# Altium schematic sheet Sheet1.SchDoc
size A3
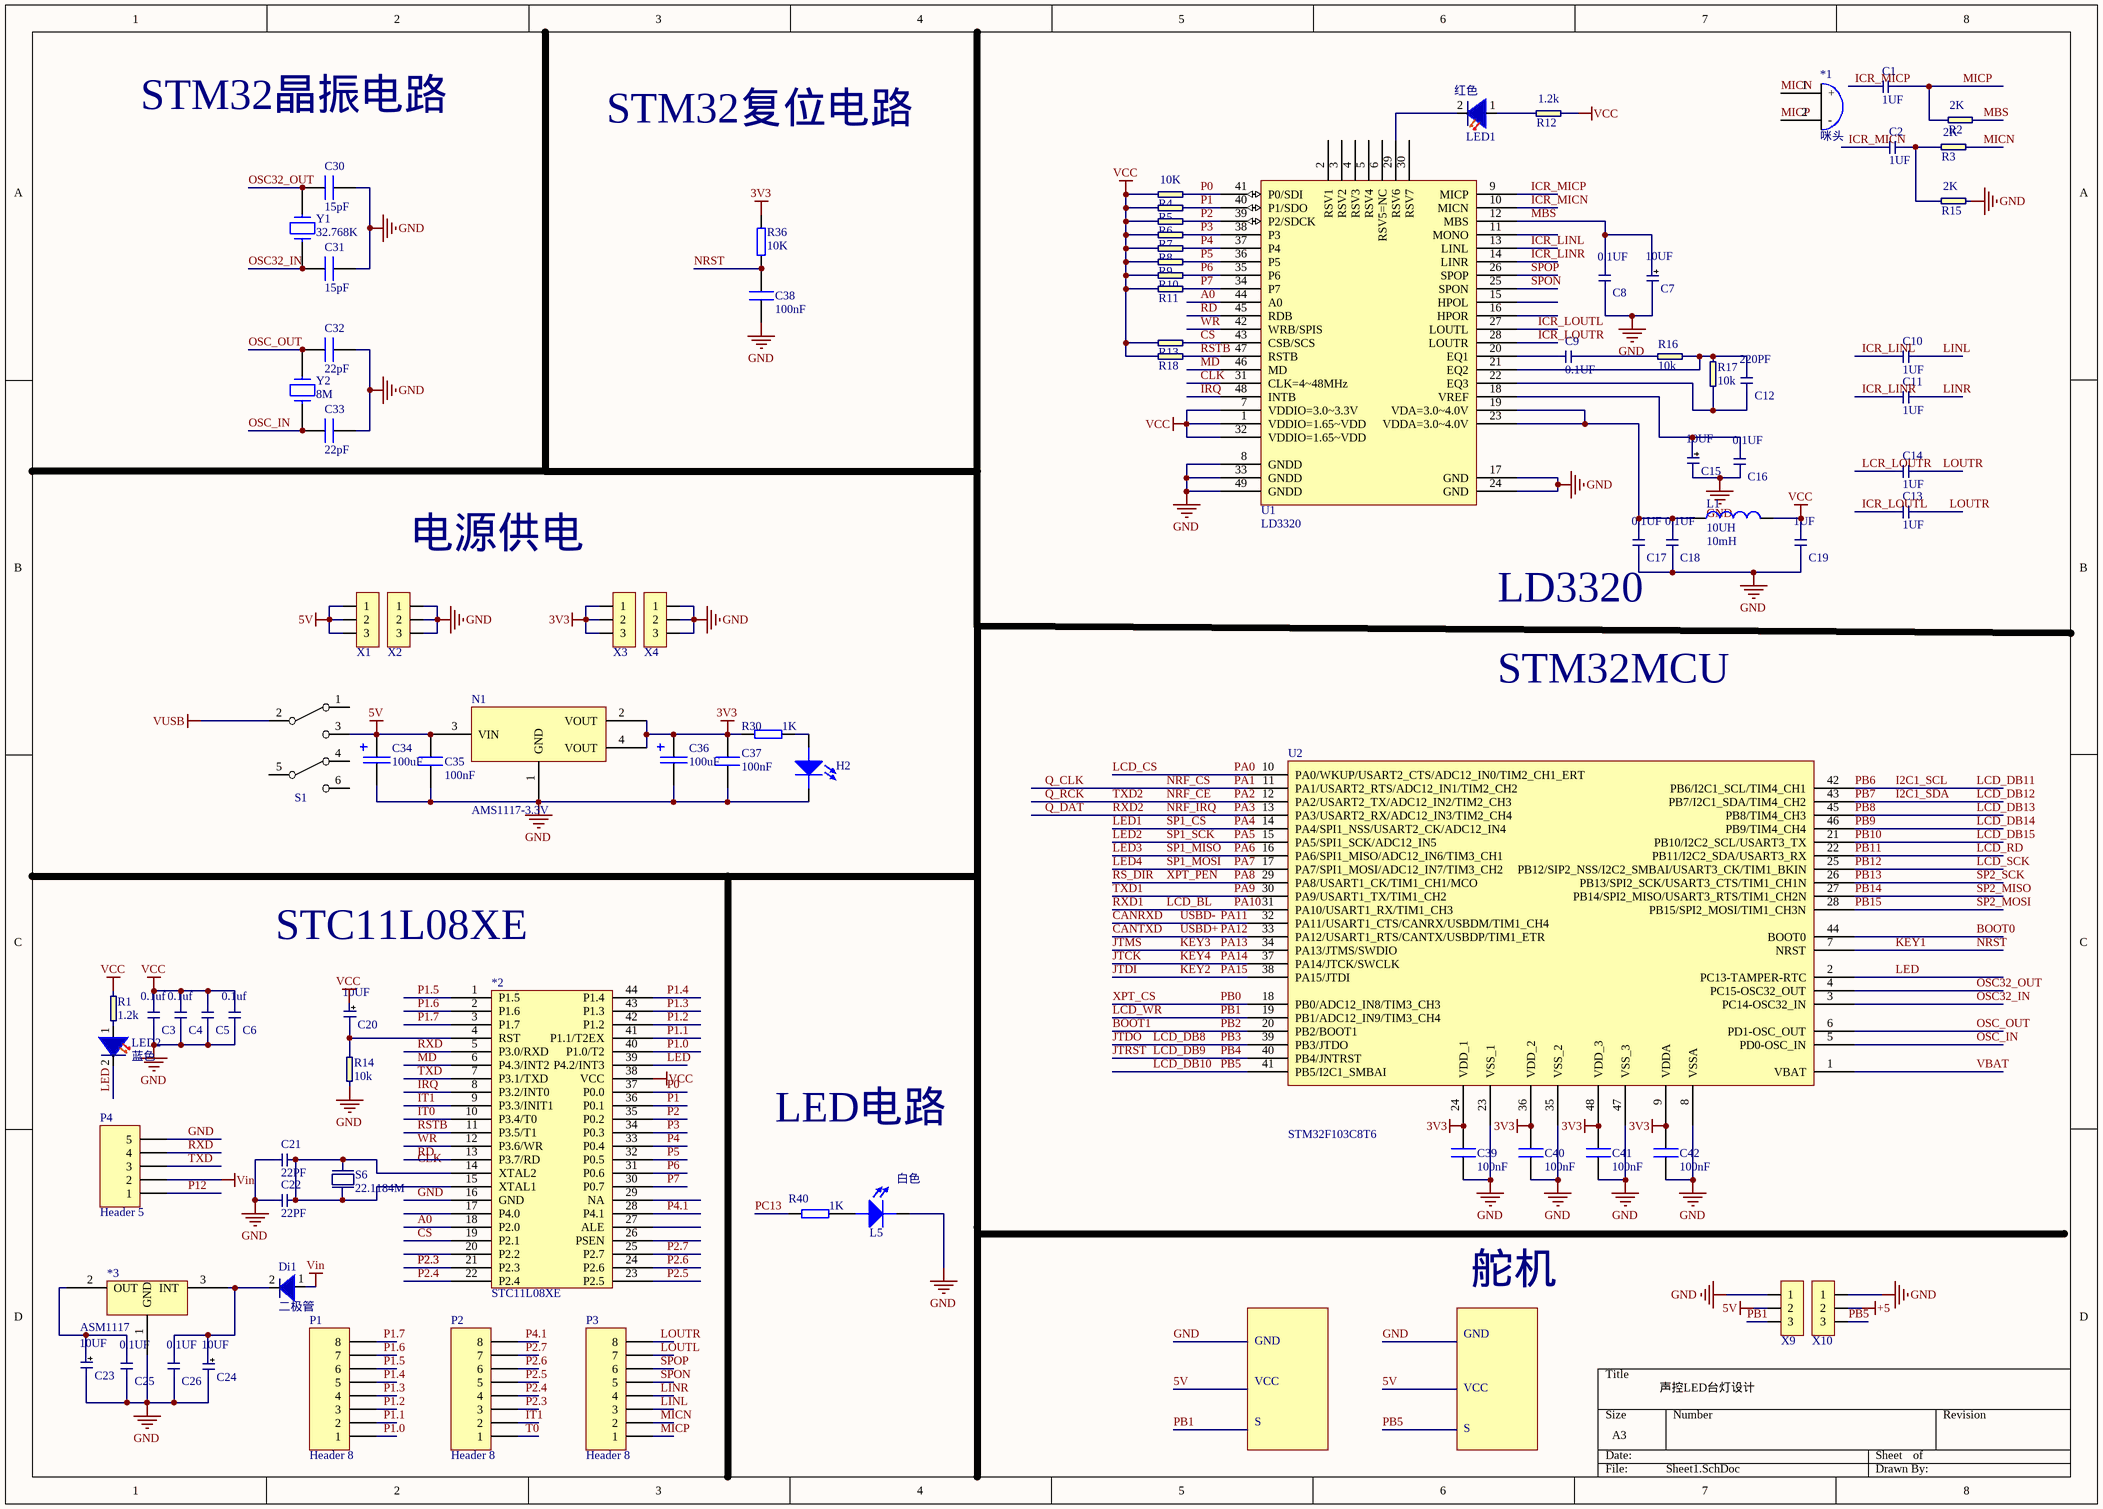
[diagram p0: Sheet1.SchDoc]

## Parts
*1  咪头  [CAPPR5-5x5]
*2  STC11L08XE  [LQFP44]
*3  ASM1117  [ASM1117]
C1  1UF  [CT2mm]
C2  1UF  [CT2mm]
C3  0.1uf  [CT2mm]
C4  0.1uf  [CT2mm]
C5  0.1uf  [CT2mm]  (value not drawn)
C6  0.1uf  [CT2mm]
C7  10UF  [Rt2mm]
C8  0.1UF  [CT2mm]
C9  0.1UF  [CT2mm]
C10  1UF  [CT2mm]
C11  1UF  [CT2mm]
C12  220PF  [CT2mm]
C13  1UF  [CT2mm]
C14  1UF  [CT2mm]
C15  10UF  [Rt2mm]
C16  0.1UF  [CT2mm]
C17  0.1UF  [CT2mm]
C18  0.1UF  [CT2mm]
C19  1UF  [CT2mm]
C20  10UF  [Rt2mm]
C21  22PF  [CT2mm]
C22  22PF  [CT2mm]
C23  10UF  [Rt2mm]
C24  10UF  [Rt2mm]
C25  0.1UF  [CT2mm]
C26  0.1UF  [CT2mm]
C30  15pF  [C0805]
C31  15pF  [C0805]
C32  22pF  [C0805]
C33  22pF  [C0805]
C34  100uF  [CAP5*5_4]
C35  100nF  [C0805]
C36  100uF  [CAP5*5_4]
C37  100nF  [C0805]
C38  100nF  [C0805]
C39  100nF  [C0805]
C40  100nF  [C0805]
C41  100nF  [C0805]
C42  100nF  [C0805]
Di1  二极管  [DT4mm]
H2  发光二极管  [LED1206]  (value not drawn)
L1  10UH  value 10mH  [INDC1005AL]
L5  发光二极管  [LED1206]  (value not drawn)
LED1  红色  [LEDT]
LED2  蓝色  [LEDT]
N1  AMS1117-3.3V  [SOT223]
P1  Header 8  [HD8]
P2  Header 8  [HD8]
P3  Header 8  [HD8]
P4  Header 5  [HD5]
R1  1.2k  [Rt2mm]
R2  2K  [Rt2mm]
R3  2K  [Rt2mm]
R4  10K  [Rt2mm]
R5  RES  [Rt2mm]  (value not drawn)
R6  RES  [Rt2mm]  (value not drawn)
R7  RES  [Rt2mm]  (value not drawn)
R8  RES  [Rt2mm]  (value not drawn)
R9  RES  [Rt2mm]  (value not drawn)
R10  RES  [Rt2mm]  (value not drawn)
R11  RES  [Rt2mm]  (value not drawn)
R12  1.2k  [Rt2mm]
R13  RES  [Rt2mm]  (value not drawn)
R14  10k  [Rt2mm]
R15  2K  [Rt2mm]
R16  10k  [Rt2mm]
R17  10k  [Rt2mm]
R18  RES  [Rt2mm]  (value not drawn)
R30  1K  [R0805]
R36  10K  [R0805]
R40  1K  [R0805]
S1  SWITCH-6  [SW-AJ]  (value not drawn)
S6  22.1184M  [晶振]
U1  LD3320  [QFN50P700X700X80-48N]
U2  STM32F103C8T6  [LQFP48]
X1  JX3  [SIP3]  (value not drawn)
X2  JX3  [SIP3]  (value not drawn)
X3  JX3  [SIP3]  (value not drawn)
X4  JX3  [SIP3]  (value not drawn)
X9  JX3  [SIP3]  (value not drawn)
X10  JX3  [SIP3]  (value not drawn)
Y1  32.768K  [FC135]
Y2  8M  [JZ-AX]

## Nets
3V3: C36.1 C37.1 C39.1 C40.1 C41.1 C42.1 N1.2(VOUT) N1.4(VOUT) R30.1 R36.2 U2.9(VDDA) U2.24(VDD_1) U2.36(VDD_2) U2.48(VDD_3) X3.1 X3.2 X3.3
5V: C34.1 C35.1 N1.3(VIN) S1.3 X1.1 X1.2 X1.3 X9.2
+5: X10.2
GND: *2.16(GND) *3.1(GND) C3.1 C4.1 C5.1 C6.1 C7.2 C8.1 C15.2 C16.1 C17.1 C18.1 C19.1 C21.2 C22.2 C23.2 C24.2 C25.1 C26.1 C30.2 C31.2 C32.2 C33.2 C34.2 C35.2 C36.2 C37.2 C38.1 C39.2 C40.2 C41.2 C42.2 H2.2(K) L5.2(K) N1.1(GND) P4.5 R14.1 R15.2 U1.8(GNDD) U1.17(GND) U1.24(GND) U1.33(GNDD) U1.49(GNDD) U2.8(VSSA) U2.23(VSS_1) U2.35(VSS_2) U2.47(VSS_3) X2.1 X2.2 X2.3 X4.1 X4.2 X4.3 X9.1 X10.1
VCC: *2.38(VCC) C3.2 C4.2 C5.2 C6.2 C19.2 C20.1 L1.2 R1.2 R4.1 R5.1 R6.1 R7.1 R8.1 R9.1 R10.1 R11.1 R12.2 R13.1 R18.1 U1.1(VDDIO=1.65~VDD) U1.7(VDDIO=3.0~3.3V) U1.32(VDDIO=1.65~VDD)
Vin: Di1.1 P4.2
VUSB: S1.2
A0: *2.18(P2.0) U1.44(A0)
BOOT0: U2.44(BOOT0)
BOOT1: U2.20(PB2/BOOT1)  [also labelled PB2]
CANRXD: U2.32(PA11/USART1_CTS/CANRX/USBDM/TIM1_CH4)  [also labelled PA11, USBD-]
CANTXD: U2.33(PA12/USART1_RTS/CANTX/USBDP/TIM1_ETR)  [also labelled PA12, USBD+]
CLK: U1.31(CLK=4~48MHz)
CS: *2.19(P2.1) R13.2 U1.43(CSB/SCS)
I2C1_SCL: U2.42(PB6/I2C1_SCL/TIM4_CH1)  [also labelled LCD_DB11, PB6]
I2C1_SDA: U2.43(PB7/I2C1_SDA/TIM4_CH2)  [also labelled LCD_DB12, PB7]
ICR_LINL: C10.2 U1.13(LINL)
ICR_LINR: C11.2 U1.14(LINR)
ICR_LOUTL: C13.2 U1.27(LOUTL)
ICR_LOUTR: U1.28(LOUTR)
ICR_MICN: C2.2 U1.10(MICN)
ICR_MICP: C1.2 U1.9(MICP)
IRQ: *2.8(P3.2/INT0) U1.48(INTB)
IT0: *2.10(P3.4/T0)
IT1: *2.9(P3.3/INIT1) P2.2
JTCK: U2.37(PA14/JTCK/SWCLK)  [also labelled KEY4, PA14]
JTDI: U2.38(PA15/JTDI)  [also labelled KEY2, PA15]
JTDO: U2.39(PB3/JTDO)  [also labelled LCD_DB8, PB3]
JTMS: U2.34(PA13/JTMS/SWDIO)  [also labelled KEY3, PA13]
JTRST: U2.40(PB4/JNTRST)  [also labelled LCD_DB9, PB4]
KEY1: C38.2 R36.1 U2.7(NRST)  [also labelled NRST]
LCD_BL: U2.31(PA10/USART1_RX/TIM1_CH3)  [also labelled PA10, RXD1]
LCD_CS: U2.10(PA0/WKUP/USART2_CTS/ADC12_IN0/TIM2_CH1_ERT)  [also labelled PA0]
LCD_DB10: U2.41(PB5/I2C1_SMBAI) X10.3  [also labelled PB5]
LCD_DB13: U2.45(PB8/TIM4_CH3)  [also labelled PB8]
LCD_DB14: U2.46(PB9/TIM4_CH4)  [also labelled PB9]
LCD_DB15: U2.21(PB10/I2C2_SCL/USART3_TX)  [also labelled PB10]
LCD_RD: U2.22(PB11/I2C2_SDA/USART3_RX)  [also labelled PB11]
LCD_SCK: U2.25(PB12/SIP2_NSS/I2C2_SMBAI/USART3_CK/TIM1_BKIN)  [also labelled PB12]
LCD_WR: U2.19(PB1/ADC12_IN9/TIM3_CH4) X9.3  [also labelled PB1]
LCR_LOUTR: C14.2
LED: *2.39(P4.2/INT3) LED2.2 U2.2(PC13-TAMPER-RTC)
LED1: U2.14(PA4/SPI1_NSS/USART2_CK/ADC12_IN4)  [also labelled PA4, SP1_CS]
LED2: U2.15(PA5/SPI1_SCK/ADC12_IN5)  [also labelled PA5, SP1_SCK]
LED3: U2.16(PA6/SPI1_MISO/ADC12_IN6/TIM3_CH1)  [also labelled PA6, SP1_MISO]
LED4: U2.17(PA7/SPI1_MOSI/ADC12_IN7/TIM3_CH2)  [also labelled PA7, SP1_MOSI]
LINL: C10.1 P3.3
LINR: C11.1 P3.4
LOUTL: P3.7
LOUTR: C13.1 C14.1 P3.8
MBS: C7.1 C8.2 R2.2 U1.12(MBS)
MD: *2.6(P4.3/INT2) U1.46(MD)
MICN: *1.1(+) P3.2 R3.2
MICP: *1.2(-) C1.1 P3.1 R2.1
NRF_CE: U2.12(PA2/USART2_TX/ADC12_IN2/TIM2_CH3)  [also labelled PA2, Q_RCK, TXD2]
NRF_CS: U2.11(PA1/USART2_RTS/ADC12_IN1/TIM2_CH2)  [also labelled PA1, Q_CLK]
NRF_IRQ: U2.13(PA3/USART2_RX/ADC12_IN3/TIM2_CH4)  [also labelled PA3, Q_DAT, RXD2]
OSC32_IN: C31.1 U2.3(PC14-OSC32_IN) Y1.1
OSC32_OUT: C30.1 U2.4(PC15-OSC32_OUT) Y1.2
OSC_IN: C33.1 U2.5(PD0-OSC_IN) Y2.1
OSC_OUT: C32.1 U2.6(PD1-OSC_OUT) Y2.2
P0: *2.37(P0.0) R4.2 U1.41(P0/SDI)
P1: *2.36(P0.1) R5.2 U1.40(P1/SDO)
P1.0: *2.40(P1.0/T2) P1.1
P1.1: *2.41(P1.1/T2EX) P1.2
P1.2: *2.42(P1.2) P1.3
P1.3: *2.43(P1.3) P1.4
P1.4: *2.44(P1.4) P1.5
P1.5: *2.1(P1.5) P1.6
P1.6: *2.2(P1.6) P1.7
P1.7: *2.3(P1.7) P1.8
P2: *2.35(P0.2) R6.2 U1.39(P2/SDCK)
P2.3: *2.21(P2.3) P2.3
P2.4: *2.22(P2.4) P2.4
P2.5: *2.23(P2.5) P2.5
P2.6: *2.24(P2.6) P2.6
P2.7: *2.25(P2.7) P2.7
P3: *2.34(P0.3) R7.2 U1.38(P3)
P4: *2.33(P0.4) R8.2 U1.37(P4)
P4.1: *2.28(P4.1) P2.8
P5: *2.32(P0.5) R9.2 U1.36(P5)
P6: *2.31(P0.6) R10.2 U1.35(P6)
P7: *2.30(P0.7) R11.2 U1.34(P7)
P12: P4.1
PA8: U2.29(PA8/USART1_CK/TIM1_CH1/MCO)  [also labelled RS_DIR, XPT_PEN]
PA9: U2.30(PA9/USART1_TX/TIM1_CH2)  [also labelled TXD1]
PB0: U2.18(PB0/ADC12_IN8/TIM3_CH3)  [also labelled XPT_CS]
PB13: U2.26(PB13/SPI2_SCK/USART3_CTS/TIM1_CH1N)  [also labelled SP2_SCK]
PB14: U2.27(PB14/SPI2_MISO/USART3_RTS/TIM1_CH2N)  [also labelled SP2_MISO]
PB15: U2.28(PB15/SPI2_MOSI/TIM1_CH3N)  [also labelled SP2_MOSI]
PC13: R40.1
RD: *2.13(P3.7/RD) U1.45(RDB)
RSTB: *2.11(P3.5/T1) R18.2 U1.47(RSTB)
RXD: *2.5(P3.0/RXD) P4.4
SPON: P3.5 U1.25(SPON)
SPOP: P3.6 U1.26(SPOP)
T0: P2.1
TXD: *2.7(P3.1/TXD) P4.3
VBAT: U2.1(VBAT)
WR: *2.12(P3.6/WR) U1.42(WRB/SPIS)
Net*2_4: *2.4(RST) C20.2 R14.2
Net*2_14: *2.14(XTAL2) *2.15(XTAL1) C21.1 C22.1 S6.1 S6.2
Net*3_2: *3.2(OUT) C23.1 C25.2
Net*3_3: *3.3(INT) C24.1 C26.2 Di1.2
NetC2_1: C2.1 R3.1 R15.1
NetC9_1: C9.1 R16.2
NetC9_2: C9.2 U1.20(EQ1)
NetC12_1: C12.1 R17.1 U1.22(EQ3)
NetC12_2: C12.2 R16.1 R17.2 U1.21(EQ2)
NetC15_1: C15.1 C16.2 U1.18(VREF)
NetC17_2: C17.2 C18.2 L1.1 U1.19(VDA=3.0~4.0V) U1.23(VDDA=3.0~4.0V)
NetH2_1: H2.1(A) R30.2
NetL5_1: L5.1(A) R40.2
NetLED1_1: LED1.1 R12.1
NetLED1_2: LED1.2 U1.29(RSV6)
NetLED2_1: LED2.1 R1.1

Not connected (* = marked no-connect by the designer): *2 17(P4.0) 20(P2.2) 26(PSEN) 27(ALE) 29(NA); S1 1 4 5 6; U1 2(RSV1) 3(RSV2) 4(RSV3) 5(RSV4) 6(RSV5=NC) 11(MONO) 15(HPOL) 16(HPOR) 30(RSV7)

## Notes on the sheet
- STM32晶振电路
- STM32复位电路
- 电源供电
- (near C17) LD3320
- STM32MCU
- STC11L08XE
- LED电路
- (near L5) 白色
- 舵机
- GND
- VCC
- 声控LED台灯设计
- S
- Labels drawn without touching a wire or pin: CLK

## Library data of the parts
C1-C6 C8-C14 C16-C19 C21 C22 C25 C26 = 瓷片电容
C7 C15 C20 C23 C24 = 电解电容
C30-C33 C35 C37-C42 = 普通贴片电容: Capacitor
C34 C36 = 极性电容器: TD_Model: *
L1 = Inductor: Code_IEC: 1005; Published: 8-Jun-2000; LatestRevisionDate: 29-May-2009; LatestRevisionNote: IPC-7351 Footprint Added.; PackageReference: 0402-A; Publisher: Altium Limited; PackageDescription: Chip Inductor; Code_JEITA: 0402
LED1 LED2 = LED
P1-P3 = Header 8: Header, 8-Pin; LatestRevisionDate: 17-Jul-2002; LatestRevisionNote: Re-released for DXP Platform.; Publisher: Altium Limited
P4 = Header 5: Header, 5-Pin; LatestRevisionDate: 17-Jul-2002; LatestRevisionNote: Re-released for DXP Platform.; Publisher: Altium Limited
R1-R4 R12 R14-R17 = RES
R30 R36 R40 = 普通贴片电阻
S6 = Y1
U1 = Component_1
X1-X4 X9 X10 = JX3: Connector
Y1 Y2 = CRYSTAL